# EasyEDA Pro project linux-card.eprj, schematic Schematic1

## Sheets
1 syske-linux-card-back
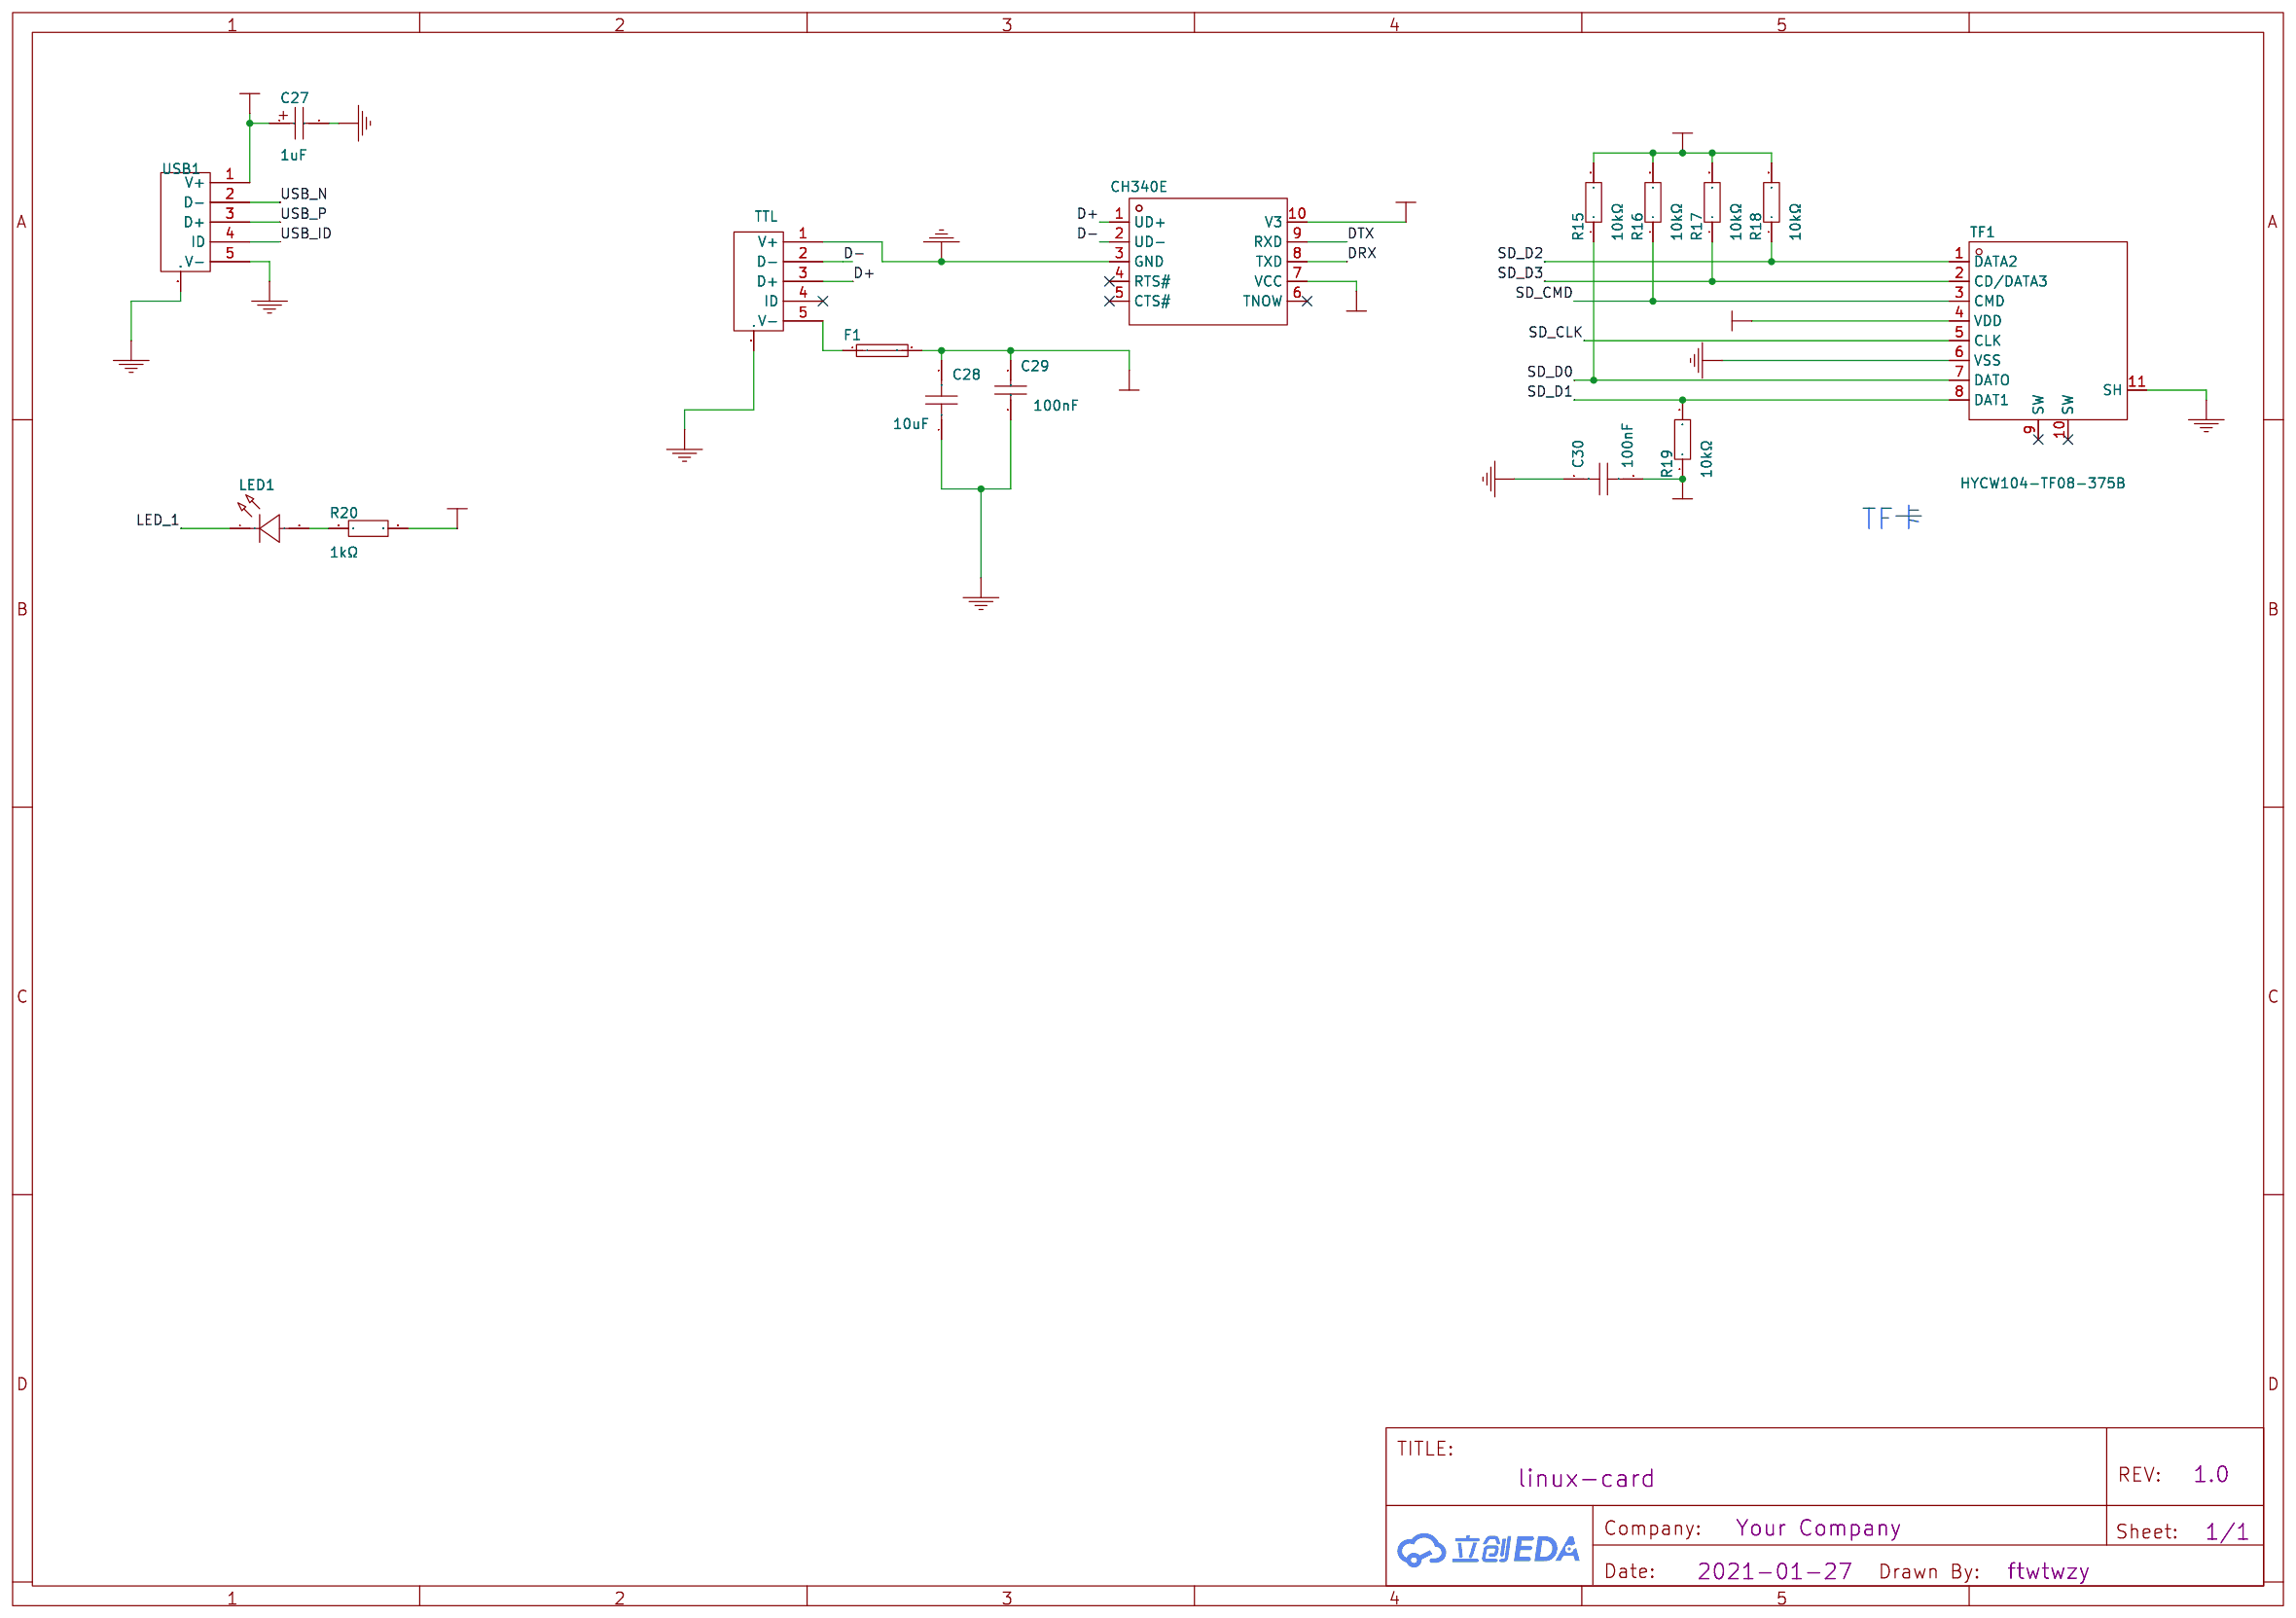
[diagram p0: syske-linux-card-back]
2 syske-linux-card
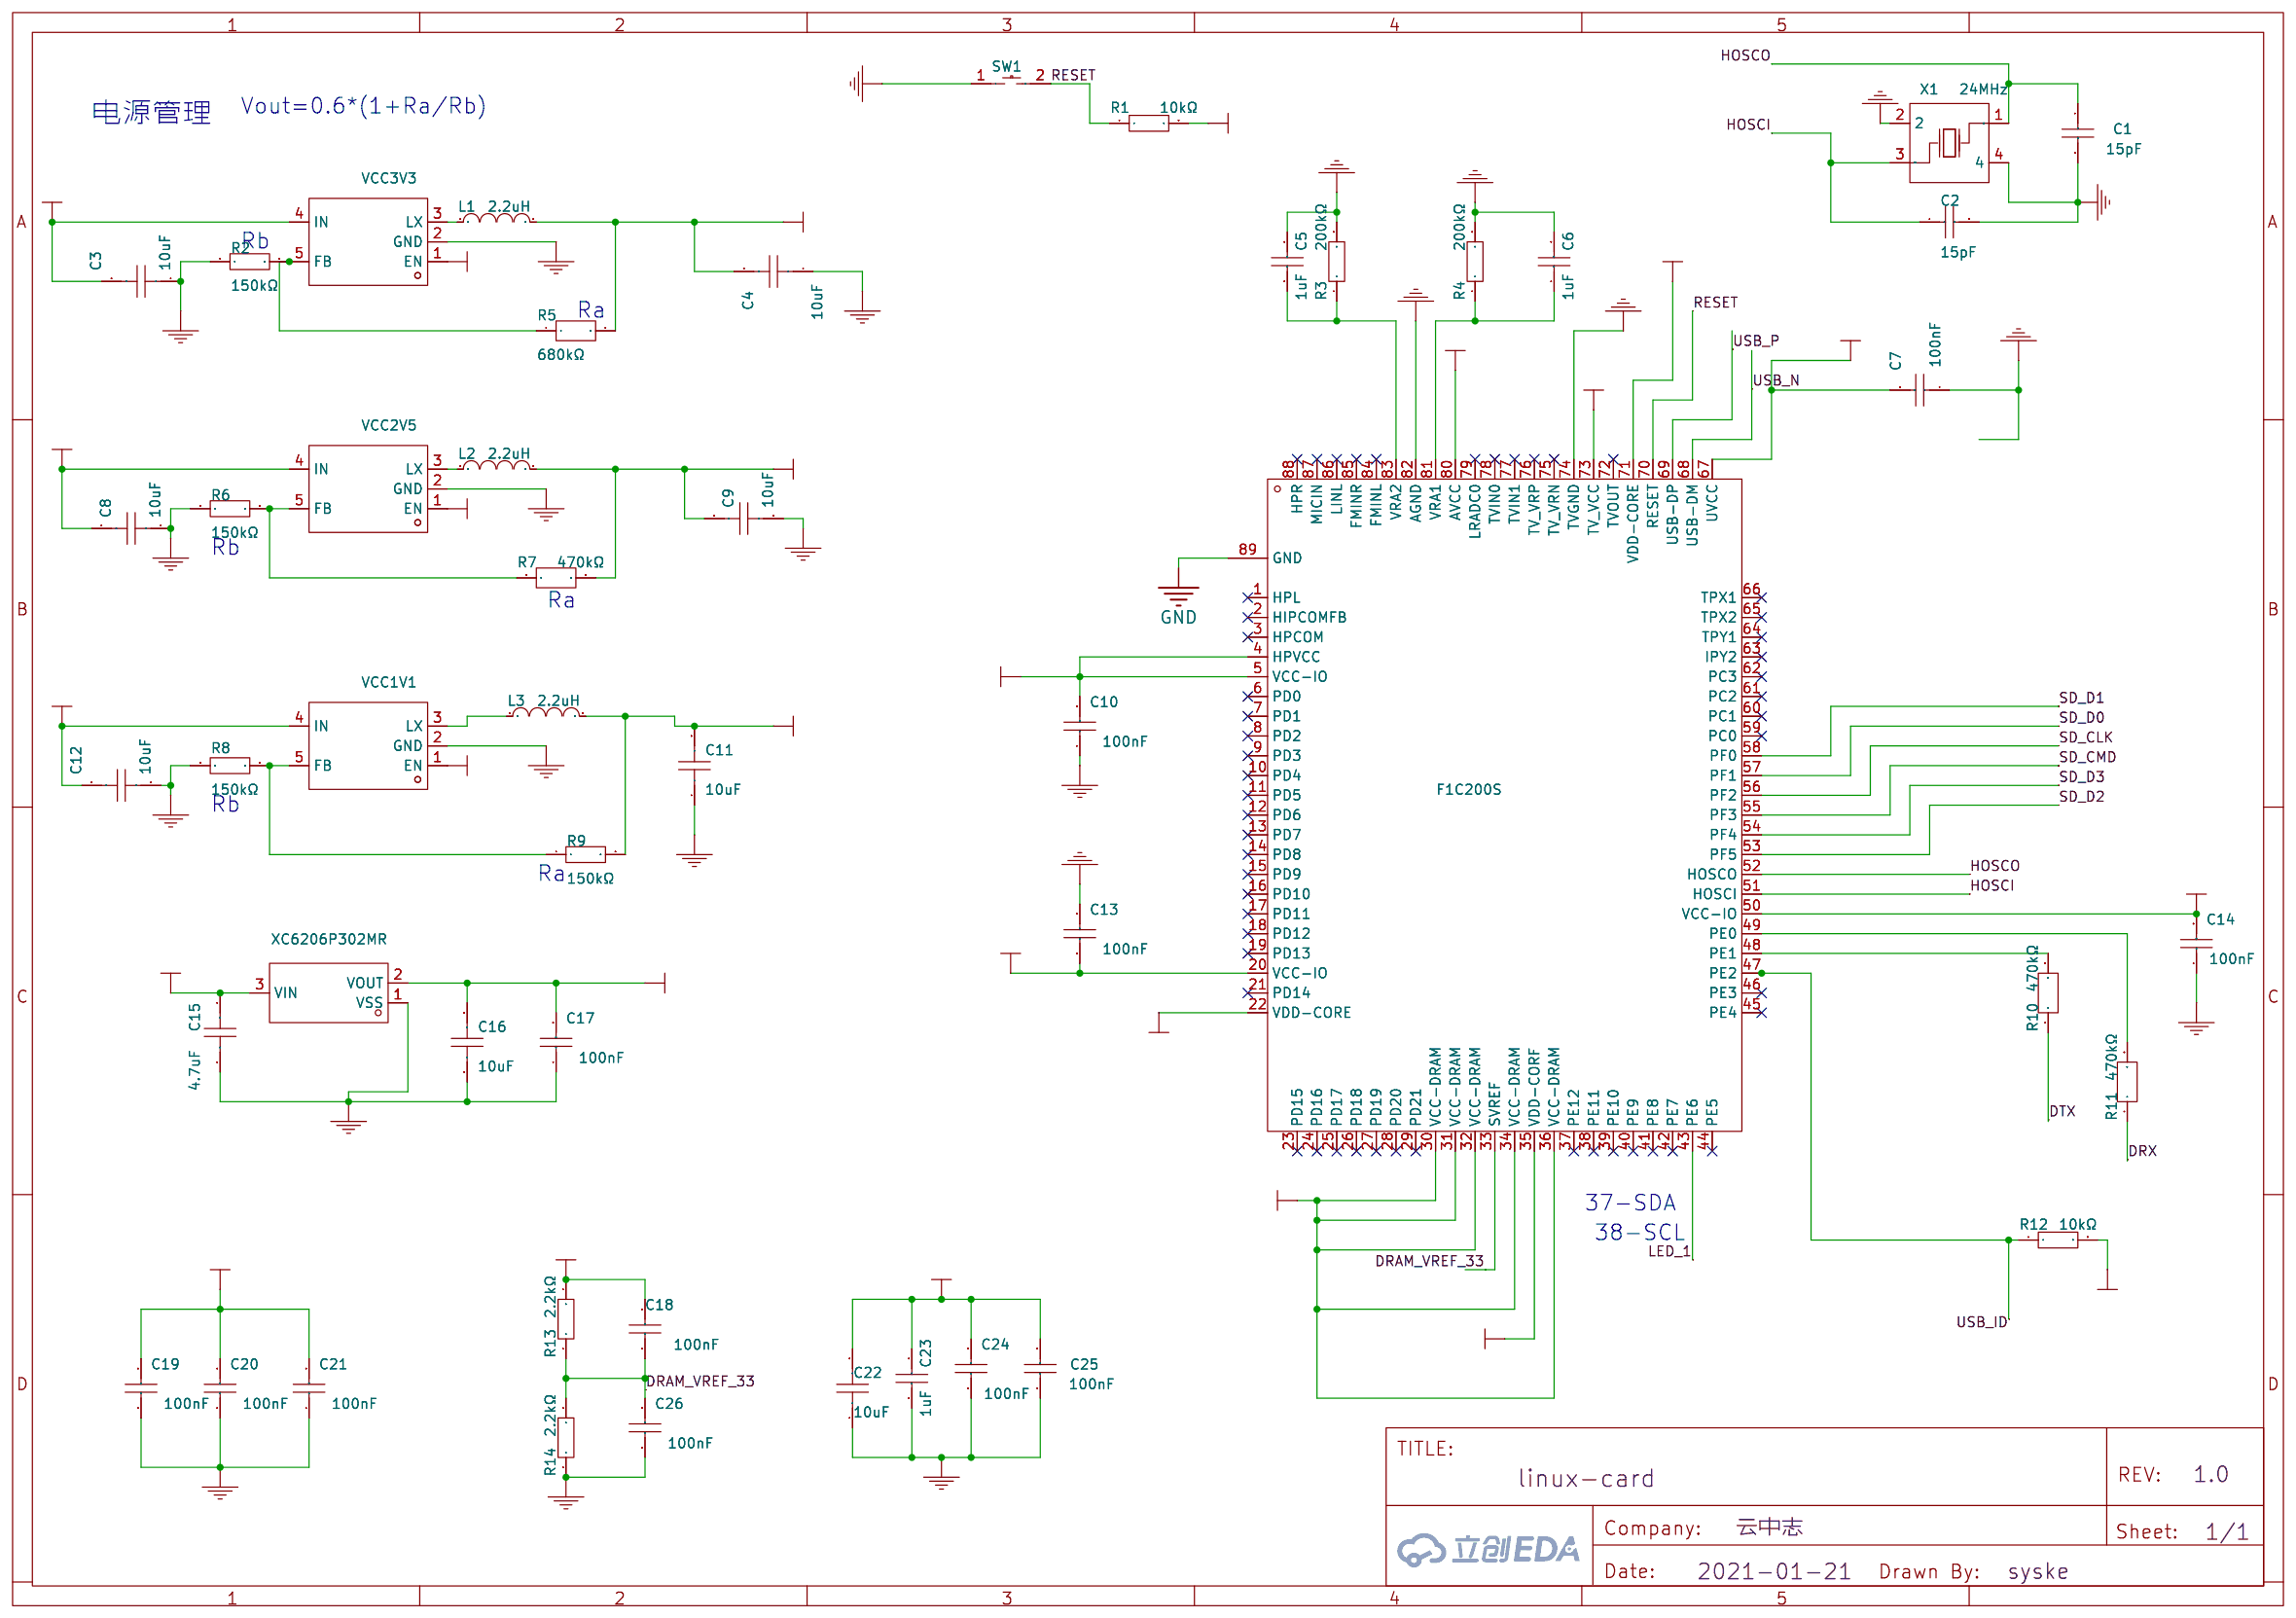
[diagram p1: syske-linux-card]

## Parts
sheet syske-linux-card-back
C27  1uF  [cap-smd_l3.2-w1.6-rd]
C28  10uF  [C0805]
C29  100nF  [C0603]
C30  100nF  [C0402]
CH340E  -  [MSOP-10_L3.0-W3.0-P0.50-LS5.0-BL]
F1  -  [F1812]
LED1  RF-BGB170TS-CB-E0  [led0805-rd_blue]
R15  10kΩ  [R0603]
R16  10kΩ  [R0603]
R17  10kΩ  [R0603]
R18  10kΩ  [R0603]
R19  10kΩ  [R0603]
R20  1kΩ  [R0805]
TF1  HYCW104-TF08-375B  [TF-SMD_HYCW104-TF08-375B]
TTL  920-E52A2021S10100  [micro-usb-smd_5p-p0.65-h-f_c10418]
USB1  920-E52A2021S10100  [micro-usb-smd_5p-p0.65-h-f_c10418]
sheet syske-linux-card
C1  15pF  [C0603]
C2  15pF  [C0603]
C3  10uF  [C0805]
C4  10uF  [C0805]
C5  1uF  [C0805]
C6  1uF  [C0805]
C7  100nF  [C0603]
C8  10uF  [C0805]
C9  10uF  [C0805]
C10  100nF  [C0603]
C11  10uF  [C0805]
C12  10uF  [C0805]
C13  100nF  [C0603]
C14  100nF  [C0603]
C15  4.7uF  [C0603]
C16  10uF  [C0805]
C17  100nF  [C0603]
C18  100nF  [C0603]
C19  100nF  [C0603]
C20  100nF  [C0603]
C21  100nF  [C0603]
C22  10uF  [C0805]
C23  1uF  [C0805]
C24  100nF  [C0603]
C25  100nF  [C0603]
C26  100nF  [C0603]
F1C200S  F1C200S  [QFN-88_L10.0-W10.0-P0.40-BL-EP6.75]
L1  2.2uH  [L0805]
L2  2.2uH  [L0805]
L3  2.2uH  [L0805]
R1  10kΩ  [R0603]
R2  150kΩ  [R0603]
R3  200kΩ  [R0402]
R4  200kΩ  [R0402]
R5  680kΩ  [R0402]
R6  150kΩ  [R0603]
R7  470kΩ  [R0805]
R8  150kΩ  [R0603]
R9  150kΩ  [R0603]
R10  470kΩ  [R0805]
R11  470kΩ  [R0805]
R12  10kΩ  [R0805]
R13  2.2kΩ  [R0805]
R14  2.2kΩ  [R0805]
SW1  TS20AN60A25B035  [key-smd_l3.0-w2.0-ls3.5]
VCC1V1  -  [SOT-23-5_L3.0-W1.7-P0.95-LS2.8-BR]
VCC2V5  -  [SOT-23-5_L3.0-W1.7-P0.95-LS2.8-BR]
VCC3V3  -  [SOT-23-5_L3.0-W1.7-P0.95-LS2.8-BR]
X1  24MHz  [OSC-SMD_4P-L3.2-W2.5-BL]
XC6206P302MR  -  [SOT-23-3_L3.0-W1.7-P0.95-LS2.9-BR]

## Library data of the parts
C27 = TAJA105K016RNJ: 容值:1uF;精度:±10%;额定电压:16V;等效串联电阻:11Ω;工作温度:-55℃~+125℃;; LCSC Part Name: 1uF ±10% 16V; Supplier Part: C7174; Manufacturer: Kyocera AVX; Supplier Footprint: CASE-A_3216; JLCPCB Part Class: Extended Part; Datasheet: https://atta.szlcsc.com/upload/public/pdf/source/20160107/1457707748219.pdf; Supplier: LCSC; Tolerance: ±10%; Rated Voltage: 16V; Equivalent Series Resistance(ESR): 11Ω; Operating Temperature: -55℃~+125℃
C3 C4 C8 C9 C11 C12 C16 C22 C28 = GRM21BR71A106KA73L: 容值:10uF;精度:±10%;额定电压:10V;温度系数:X7R;; LCSC Part Name: 10uF ±10% 10V; Supplier Part: C117956; Manufacturer: muRata(村田); LCSC On Sale: 1; Supplier Footprint: 0805; JLCPCB Part Class: Extended Part; JLCPCB On Sale: 1; Datasheet: https://atta.szlcsc.com/upload/public/pdf/source/20180719/C117956_575F9B872BA9B36F75A1EB88B277DBD9.pdf; Supplier: LCSC; Tolerance: ±10%; Voltage Rated: 10V; Temperature Coefficient: X7R
C7 C10 C13 C14 C17-C21 C24-C26 C29 = CL10B104KO8NNNC: 容值:100nF;精度:±10%;额定电压:16V;温度系数:X7R;; LCSC Part Name: 100nF ±10% 16V; Supplier Part: C66501; Manufacturer: SAMSUNG(三星); Supplier Footprint: 0603; JLCPCB Part Class: Extended Part; Datasheet: https://atta.szlcsc.com/upload/public/pdf/source/20160218/1457707763339.pdf; Supplier: LCSC; Tolerance: ±10%; Voltage Rated: 16V; Temperature Coefficient: X7R
C30 = CL05B104KO5NFNC: 容值:100nF;精度:±10%;额定电压:16V;温度系数:X7R;; LCSC Part Name: 100nF ±10% 16V; Supplier Part: C307424; Manufacturer: SAMSUNG(三星); LCSC On Sale: 1; Supplier Footprint: 0402; JLCPCB Part Class: Extended Part; JLCPCB On Sale: 0; Datasheet: https://atta.szlcsc.com/upload/public/pdf/source/20181009/C307424_37C656BA3D9610165E1357AD42892117.pdf; Supplier: LCSC; Tolerance: ±10%; Voltage Rated: 16V; Temperature Coefficient: X7R
CH340E = CH340E_1: 类型:Transceiver;协议类别:USB 2.0;驱动器/接收器数:-;数据速率:2Mbps;; Supplier Part: C99652; Manufacturer: WCH(南京沁恒); LCSC On Sale: 1; Supplier Footprint: MSOP-10; JLCPCB Part Class: Extended Part; JLCPCB On Sale: 1; Datasheet: https://atta.szlcsc.com/upload/public/pdf/source/20200819/C99652_97FFC0DF2539BFF05CD752AD9221D632.pdf; Supplier: LCSC; Type: Transceiver; Protocol: USB 2.0; Data Rate: 2Mbps; Supply Voltage: 3.3V, 5V
F1 = K1812L300DR: PPTC自恢复保险丝; LCSC Part Name: 3A 6V; Supplier Part: C2892442; Manufacturer: KUU; LCSC On Sale: 1; Supplier Footprint: 1812; JLCPCB Part Class: Extended Part; JLCPCB On Sale: 0; Datasheet: https://atta.szlcsc.com/upload/public/pdf/source/20210907/AEE88DCBE41BD8CD599872D98DFC98CB.pdf; Supplier: LCSC
LED1 = RF-BGB170TS-CB-E0: 发光颜色:蓝灯;二极管配置:-;透镜颜色:-;主波长:-;峰值波长:-;色温:-;测试电流:20mA;功率:70mW;发光角度:140°;安装方式:正贴;工作温度:-40℃~+85℃;; LCSC Part Name: 蓝灯 正贴; Supplier Part: C2908306; Manufacturer: Refond(瑞丰); Supplier Footprint: 0805; JLCPCB Part Class: Extended Part; Datasheet: https://atta.szlcsc.com/upload/public/pdf/source/20211101/C871A18E9B6E101B84BDF0C661245F86.pdf; Supplier: LCSC; Emitted Color: 蓝灯; Forward Current: 20mA; Power Dissipation: 70mW; Viewing Angle: 140°; Mounting Sytle: 正贴; Operating Temperature: -40℃~+85℃
R1 R15-R19 = MCR03EZPFX1002: 电阻类型:厚膜电阻;阻值:10kΩ;精度:±1%;功率:100mW;温度系数:±100ppm/℃;最大工作电压:50V;工作温度范围:-55℃~+155℃;; LCSC Part Name: 10kΩ ±1%; Supplier Part: C114853; Manufacturer: ROHM(罗姆); LCSC On Sale: 1; Supplier Footprint: 0603; JLCPCB Part Class: Extended Part; JLCPCB On Sale: 1; Datasheet: https://atta.szlcsc.com/upload/public/pdf/source/20170620/1497944780307.pdf; Supplier: LCSC; Type: 厚膜电阻; Tolerance: ±1%; Power(Watts): 100mW; Temperature Coefficient: ±100ppm/℃; Overload Voltage (Max): 50V; Operating Temperature Range: -55℃~+155℃
R20 = CR0805F81001G_1: 电阻类型:厚膜电阻;阻值:1kΩ;精度:±1%;功率:1/8W;温度系数:±100ppm/℃;最大工作电压:150V;工作温度范围:-55℃~+125℃;; LCSC Part Name: 1kΩ ±1%; Supplier Part: C101404; Manufacturer: LIZ(丽智电子); Manufacturer Part: CR0805F81001G; LCSC On Sale: 1; Supplier Footprint: 0805; JLCPCB Part Class: Extended Part; JLCPCB On Sale: 1; Datasheet: https://atta.szlcsc.com/upload/public/pdf/source/20170408/1491631488196.pdf; Supplier: LCSC; Type: 厚膜电阻; Tolerance: ±1%; Power(Watts): 1/8W; Temperature Coefficient: ±100ppm/℃; Overload Voltage (Max): 150V; Operating Temperature Range: -55℃~+125℃
TF1 = HYCW104-TF08-375B: LCSC Part Name: TF 短体带检测PIN 3.75H; Supplier Part: C2962029; Manufacturer: 华宇创; Supplier Footprint: SMD; JLCPCB Part Class: Extended Part; Datasheet: https://atta.szlcsc.com/upload/public/pdf/source/20220124/026466E43C05835E55B94B7B15948715.pdf; Supplier: LCSC
TTL USB1 = 920-E52A2021S10100: 连接器类型:Micro-B;标准:USB 2.0;公母:母座;触点数量:5;端口数量:1;额定电流 - 电源:1A;; LCSC Part Name: Micro-B 母座; Supplier Part: C10418; Manufacturer: 精拓金; Supplier Footprint: SMD; JLCPCB Part Class: Extended Part; Datasheet: https://atta.szlcsc.com/upload/public/pdf/source/20210305/C10418_4890444E73C7CF5EB311058F76E5ECA4.pdf; Supplier: LCSC; Connector Type: Micro-B; Standard: USB 2.0; Gender: 母座; Number of Contacts: 5; Number of Ports: 1; Current Rating - Power (Max): 1A
C1 C2 = CL10C150JB8NNNC: 容值:15pF;精度:±5%;额定电压:50V;温度系数:C0G;; LCSC Part Name: 15pF ±5% 50V; Supplier Part: C1644; Manufacturer: SAMSUNG(三星); Supplier Footprint: 0603; JLCPCB Part Class: Basic Part; Datasheet: https://atta.szlcsc.com/upload/public/pdf/source/20160103/1457707686387.pdf; Supplier: LCSC; Tolerance: ±5%; Voltage Rated: 50V; Temperature Coefficient: C0G
C5 C6 C23 = CL21B105KOFNNNE: 容值:1uF;精度:±10%;额定电压:16V;温度系数:X7R;; LCSC Part Name: 1uF ±10% 16V; Supplier Part: C24123; Manufacturer: SAMSUNG(三星); LCSC On Sale: 1; Supplier Footprint: 0805; JLCPCB Part Class: Extended Part; JLCPCB On Sale: 1; Datasheet: https://atta.szlcsc.com/upload/public/pdf/source/20160103/1457707711583.pdf; Supplier: LCSC; Tolerance: ±10%; Voltage Rated: 16V; Temperature Coefficient: X7R
C15 = CL10A475KP8NNND: 容值:4.7uF;精度:±10%;额定电压:10V;温度系数:X5R;; LCSC Part Name: 4.7uF ±10% 10V; Supplier Part: C307468; Manufacturer: SAMSUNG(三星); LCSC On Sale: 1; Supplier Footprint: 0603; JLCPCB Part Class: Extended Part; JLCPCB On Sale: 0; Datasheet: https://atta.szlcsc.com/upload/public/pdf/source/20181009/C307468_4351B4C23F20E8FB6032D87C6BCAEC06.pdf; Supplier: LCSC; Tolerance: ±10%; Voltage Rated: 10V; Temperature Coefficient: X5R
F1C200S = F1C200S: Supplier Part: C2879851; Manufacturer: Allwinner(全志); Supplier Footprint: QFN-88; JLCPCB Part Class: Extended Part; Datasheet: https://atta.szlcsc.com/upload/public/pdf/source/20211016/C2879851_80200E64F493B5C5B5C583D1EECFE2F1.pdf; Supplier: LCSC; LCSC On Sale: 0; JLCPCB On Sale: 1
L1-L3 = CMP201209UD2R2KT: 电感值:2.2uH;精度:±10%;额定电流:-;饱和电流(Isat):-;直流电阻(DCR):-;; LCSC Part Name: 2.2uH ±10%; Supplier Part: C395014; Manufacturer: FH(风华); LCSC On Sale: 1; Supplier Footprint: 0805; JLCPCB Part Class: Extended Part; JLCPCB On Sale: 1; Datasheet: https://atta.szlcsc.com/upload/public/pdf/source/20190805/C395014_F19EA47B9A919FEB59AF07E6F4C8B00B.pdf; Supplier: LCSC; Tolerance: ±10%
R2 R6 R8 R9 = 0603WAF1503T5E: 电阻类型:厚膜电阻;阻值:150kΩ;精度:±1%;功率:100mW;温度系数:±100ppm/℃;最大工作电压:75V;工作温度范围:-55℃~+155℃;; LCSC Part Name: 150kΩ ±1% 100mW; Supplier Part: C22807; Manufacturer: UNI-ROYAL(厚声); Supplier Footprint: 0603; JLCPCB Part Class: Basic Part; Datasheet: https://atta.szlcsc.com/upload/public/pdf/source/20200306/C422600_1E6D84923E4A46A82E41ADD87F860B5C.pdf; Supplier: LCSC; Type: 厚膜电阻; Tolerance: ±1%; Power(Watts): 100mW; Temperature Coefficient: ±100ppm/℃; Overload Voltage (Max): 75V; Operating Temperature Range: -55℃~+155℃
R3 R4 = CR0402JF0204G: 电阻类型:厚膜电阻;阻值:200kΩ;精度:±5%;功率:1/16W;温度系数:±200ppm/℃;最大工作电压:50V;工作温度范围:-55℃~+125℃;; LCSC Part Name: 200kΩ ±5%; Supplier Part: C100610; Manufacturer: LIZ(丽智电子); LCSC On Sale: 1; Supplier Footprint: 0402; JLCPCB Part Class: Extended Part; JLCPCB On Sale: 1; Datasheet: https://atta.szlcsc.com/upload/public/pdf/source/20170408/1491631232251.pdf; Supplier: LCSC; Type: 厚膜电阻; Tolerance: ±5%; Power(Watts): 1/16W; Temperature Coefficient: ±200ppm/℃; Overload Voltage (Max): 50V; Operating Temperature Range: -55℃~+125℃
R5 = ERJ2RKF6803X: 阻值:680kΩ;精度:±1%;功率:1/10W;温度系数:±100ppm/℃;最大工作电压:100V;工作温度范围:-55℃~+155℃;; LCSC Part Name: 680kΩ ±1%; Supplier Part: C413123; Manufacturer: PANASONIC(松下); LCSC On Sale: 1; Supplier Footprint: 0402; JLCPCB Part Class: Extended Part; JLCPCB On Sale: 1; Datasheet: https://atta.szlcsc.com/upload/public/pdf/source/20190820/C413123_240B12B0C956A3AEC2E992BD5712269B.pdf; Supplier: LCSC; Tolerance: ±1%; Power(Watts): 1/10W; Temperature Coefficient: ±100ppm/℃; Overload Voltage (Max): 100V; Operating Temperature Range: -55℃~+155℃
R7 R10 R11 = ARG05DTC4703: 电阻类型:薄膜电阻;阻值:470kΩ;精度:±0.5%;功率:125mW;温度系数:±25ppm/℃;最大工作电压:150V;工作温度范围:-55℃~+155℃;; LCSC Part Name: 470kΩ ±0.5% 125mW; Supplier Part: C2828777; Manufacturer: Viking(光颉); LCSC On Sale: 1; Supplier Footprint: 0805; JLCPCB Part Class: Extended Part; JLCPCB On Sale: 1; Datasheet: https://atta.szlcsc.com/upload/public/pdf/source/20210426/C2828737_35D2DDB0BDDA00747C2712435E28BBD4.pdf; Supplier: LCSC; Type: 薄膜电阻; Tolerance: ±0.5%; Power(Watts): 125mW; Temperature Coefficient: ±25ppm/℃; Overload Voltage (Max): 150V; Operating Temperature Range: -55℃~+155℃
R12 = RS-05K103JT: 阻值:10kΩ;精度:±5%;功率:125mW;温度系数:±100ppm/℃;最大工作电压:150V;工作温度范围:-55℃~+155℃;; LCSC Part Name: 10kΩ ±5%; Supplier Part: C115295; Manufacturer: FH(风华); LCSC On Sale: 1; Supplier Footprint: 0805; JLCPCB Part Class: Extended Part; JLCPCB On Sale: 1; Datasheet: https://atta.szlcsc.com/upload/public/pdf/source/20170712/C115295_1499832270595814228.pdf; Supplier: LCSC; Tolerance: ±5%; Power(Watts): 125mW; Temperature Coefficient: ±100ppm/℃; Overload Voltage (Max): 150V; Operating Temperature Range: -55℃~+155℃
R13 R14 = CR0805F82201G: 电阻类型:厚膜电阻;阻值:2.2kΩ;精度:±1%;功率:1/8W;温度系数:±100ppm/℃;最大工作电压:150V;工作温度范围:-55℃~+125℃;; LCSC Part Name: 2.2kΩ ±1%; Supplier Part: C101565; Manufacturer: LIZ(丽智电子); LCSC On Sale: 1; Supplier Footprint: 0805; JLCPCB Part Class: Extended Part; JLCPCB On Sale: 1; Datasheet: https://atta.szlcsc.com/upload/public/pdf/source/20170408/1491635649438.pdf; Supplier: LCSC; Type: 厚膜电阻; Tolerance: ±1%; Power(Watts): 1/8W; Temperature Coefficient: ±100ppm/℃; Overload Voltage (Max): 150V; Operating Temperature Range: -55℃~+125℃
SW1 = TS20AN60A25B035: Supplier Part: C2844491; Manufacturer: 虹穗; LCSC On Sale: 1; Supplier Footprint: SMD; JLCPCB Part Class: Extended Part; JLCPCB On Sale: 1; Datasheet: https://atta.szlcsc.com/upload/public/pdf/source/20210709/C2844491_65D43DCC68AE9398845D64E60FD26D2C.pdf; Supplier: LCSC
VCC1V1 VCC2V5 VCC3V3 = SY8088AAC_1: 功能类型:降压型;同步整流:-;输出通道数:-;拓扑结构:-;输入电压:-;输出电流(最大值):-;开关频率:-;; LCSC Part Name: 降压型; Supplier Part: C79313; Manufacturer: 矽力杰silergy; Manufacturer Part: SY8088AAC; LCSC On Sale: 1; Supplier Footprint: SOT-23-5; JLCPCB Part Class: Extended Part; JLCPCB On Sale: 1; Datasheet: https://atta.szlcsc.com/upload/public/pdf/source/20170329/1490752163260.pdf; Supplier: LCSC; Function: 降压型
X1 = S3224000161050: 晶振类型:贴片无源晶振;频率:24MHz;频率公差:±10ppm;负载电容:16pF;等效串联电阻(ESR):50Ω;工作温度:-40℃~+85℃;; LCSC Part Name: 24MHz ±10ppm 16pF; Supplier Part: C479201; Manufacturer: JGHC(晶光华); LCSC On Sale: 1; Supplier Footprint: SMD3225-4P; JLCPCB Part Class: Extended Part; JLCPCB On Sale: 1; Datasheet: https://atta.szlcsc.com/upload/public/pdf/source/20200102/C479201_31FD0A37453A44A10EC201156349AC14.pdf; Supplier: LCSC; Crystal Type: 贴片无源晶振; Frequency Tolerance: ±10ppm; Load Capacitance: 16pF; Equivalent Series Resistance (ESR): 50Ω; Operating Temperature: -40℃~+85℃
XC6206P302MR = XC6206P302MR: 输出类型:固定;输出极性:正;输出通道数:1;最大输入电压:8V;输出电压:3V;压差:240mV@(50mA);输出电流:100mA;电源纹波抑制比(PRSS):40dB@(1kHz);; LCSC Part Name: Vin=8V Vout=3V 100mA 40dB@(1kHz); Supplier Part: C347375; Manufacturer: UMW(友台半导体); LCSC On Sale: 1; Supplier Footprint: SOT-23; JLCPCB Part Class: Extended Part; JLCPCB On Sale: 1; Datasheet: https://atta.szlcsc.com/upload/public/pdf/source/20211011/2FF0EF86CD1346BC1578534D6C1D0E45.pdf; Supplier: LCSC; Output Type: 固定; Output Polarity: 正; Number of Outputs: 1; Maximum Input Voltage: 8V; Output Voltage: 3V; Dropout Voltage: 240mV@(50mA); Output Current: 100mA; Power Supply Rejection Ratio (PRSS): 40dB@(1kHz)

## Nets
5VIN: C3.2 C8.2 C12.2 C15.1 C27.1 C28.2 C29.2 CH340E.7(VCC) CH340E.10(V3) F1.2 USB1.1(V+) VCC1V1.1(EN) VCC1V1.4(IN) VCC2V5.1(EN) VCC2V5.4(IN) VCC3V3.1(EN) VCC3V3.4(IN) XC6206P302MR.3(VIN)
+1V1: C11.2 C19.2 C20.2 C21.2 F1C200S.22(VDD-CORE) F1C200S.35(VDD-CORF) F1C200S.71(VDD-CORE) L3.2 R9.2
+2V5: C9.2 C18.2 C22.2 C23.2 C24.2 C25.2 F1C200S.30(VCC-DRAM) F1C200S.31(VCC-DRAM) F1C200S.32(VCC-DRAM) F1C200S.34(VCC-DRAM) F1C200S.36(VCC-DRAM) L2.2 R7.2 R13.2
+3V0: C16.2 C17.2 F1C200S.80(AVCC) XC6206P302MR.2(VOUT)
+3V3: C4.2 C7.2 C10.2 C13.1 C14.2 C30.2 F1C200S.4(HPVCC) F1C200S.5(VCC-IO) F1C200S.20(VCC-IO) F1C200S.50(VCC-IO) F1C200S.67(UVCC) F1C200S.73(TV_VCC) L1.2 R1.2 R5.2 R12.2 R15.2 R16.2 R17.2 R18.2 R19.1 R20.2 TF1.4(VDD)
GND: C1.2 C2.2 C3.1 C4.1 C5.2 C6.2 C7.1 C8.1 C9.1 C10.1 C11.1 C12.1 C13.2 C14.1 C15.2 C16.1 C17.1 C19.1 C20.1 C21.1 C22.1 C23.1 C24.1 C25.1 C26.1 C27.2 C28.1 C29.1 C30.1 CH340E.3(GND) F1C200S.74(TVGND) F1C200S.82(AGND) F1C200S.89(GND) R2.1 R3.2 R4.2 R6.1 R8.1 R14.1 SW1.1 TF1.6(VSS) TF1.11(SH) TTL.0(MTN) TTL.1(V+) USB1.0(MTN) USB1.5(V-) VCC1V1.2(GND) VCC2V5.2(GND) VCC3V3.2(GND) X1.2 X1.4 XC6206P302MR.1(VSS)
D+: CH340E.1(UD+) TTL.3(D+)
D-: CH340E.2(UD-) TTL.2(D-)
DRAM_VREF_33: C18.1 C26.2 F1C200S.33(SVREF) R13.1 R14.2
DRX: CH340E.8(TXD) R11.1
DTX: CH340E.9(RXD) R10.1
HOSCI: C2.1 F1C200S.51(HOSCI) X1.3(OSC2)
HOSCO: C1.1 F1C200S.52(HOSCO) X1.1(OSC1)
LED_1: F1C200S.43(PE6) LED1.1(K)
RESET: F1C200S.70(RESET) R1.1 SW1.2
SD_CLK: F1C200S.56(PF2) TF1.5(CLK)
SD_CMD: F1C200S.55(PF3) R16.1 TF1.3(CMD)
SD_D0: F1C200S.57(PF1) R15.1 TF1.7(DATO)
SD_D1: F1C200S.58(PF0) R19.2 TF1.8(DAT1)
SD_D2: F1C200S.53(PF5) R18.1 TF1.1(DATA2)
SD_D3: F1C200S.54(PF4) R17.1 TF1.2(CD/DATA3)
USB_ID: F1C200S.47(PE2) R12.1 USB1.4(ID)
USB_N: F1C200S.68(USB-DM) USB1.2(D-)
USB_P: F1C200S.69(USB-DP) USB1.3(D+)
$3N427: C6.1 F1C200S.81(VRA1) R4.1
$3N803: F1C200S.49(PE0) R11.2
$3N815: F1C200S.48(PE1) R10.2
$3N9743: C5.1 F1C200S.83(VRA2) R3.1
Net-(F1-1): F1.1 TTL.5(V-)
Net-(L1-1): L1.1 VCC3V3.3(LX)
Net-(L2-1): L2.1 VCC2V5.3(LX)
Net-(L3-1): L3.1 VCC1V1.3(LX)
Net-(LED1-2): LED1.2(A) R20.1
Net-(R2-2): R2.2 R5.1 VCC3V3.5(FB)
Net-(R6-2): R6.2 R7.1 VCC2V5.5(FB)
Net-(R8-2): R8.2 R9.1 VCC1V1.5(FB)

Not connected (* = marked no-connect by the designer): CH340E 4(RTS#)* 5(CTS#)* 6(TNOW)*; F1C200S 1(HPL)* 2(HIPCOMFB)* 3(HPCOM)* 6(PD0)* 7(PD1)* 8(PD2)* 9(PD3)* 10(PD4)* 11(PD5)* 12(PD6)* 13(PD7)* 14(PD8)* 15(PD9)* 16(PD10)* 17(PD11)* 18(PD12)* 19(PD13)* 21(PD14)* 23(PD15)* 24(PD16)* 25(PD17)* 26(PD18)* 27(PD19)* 28(PD20)* 29(PD21)* 37(PE12)* 38(PE11)* 39(PE10)* 40(PE9)* 41(PE8)* 42(PE7)* 44(PE5)* 45(PE4)* 46(PE3)* 59(PC0)* 60(PC1)* 61(PC2)* 62(PC3)* 63(IPY2)* 64(TPY1)* 65(TPX2)* 66(TPX1)* 72(TVOUT)* 75(TV_VRN)* 76(TV_VRP)* 77(TVIN1)* 78(TVIN0)* 79(LRADC0)* 84(FMINL)* 85(FMINR)* 86(LINL)* 87(MICIN)* 88(HPR)*; TF1 9(SW)* 10(SW)*; TTL 4(ID)*

## Notes on the sheets
sheet 1
- TF卡
sheet 2
- Vout=0.6*(1+Ra/Rb)
- 电源管理
- Rb
- Ra
- Rb
- Ra
- Rb
- Ra
- 37-SDA
- 38-SCL
